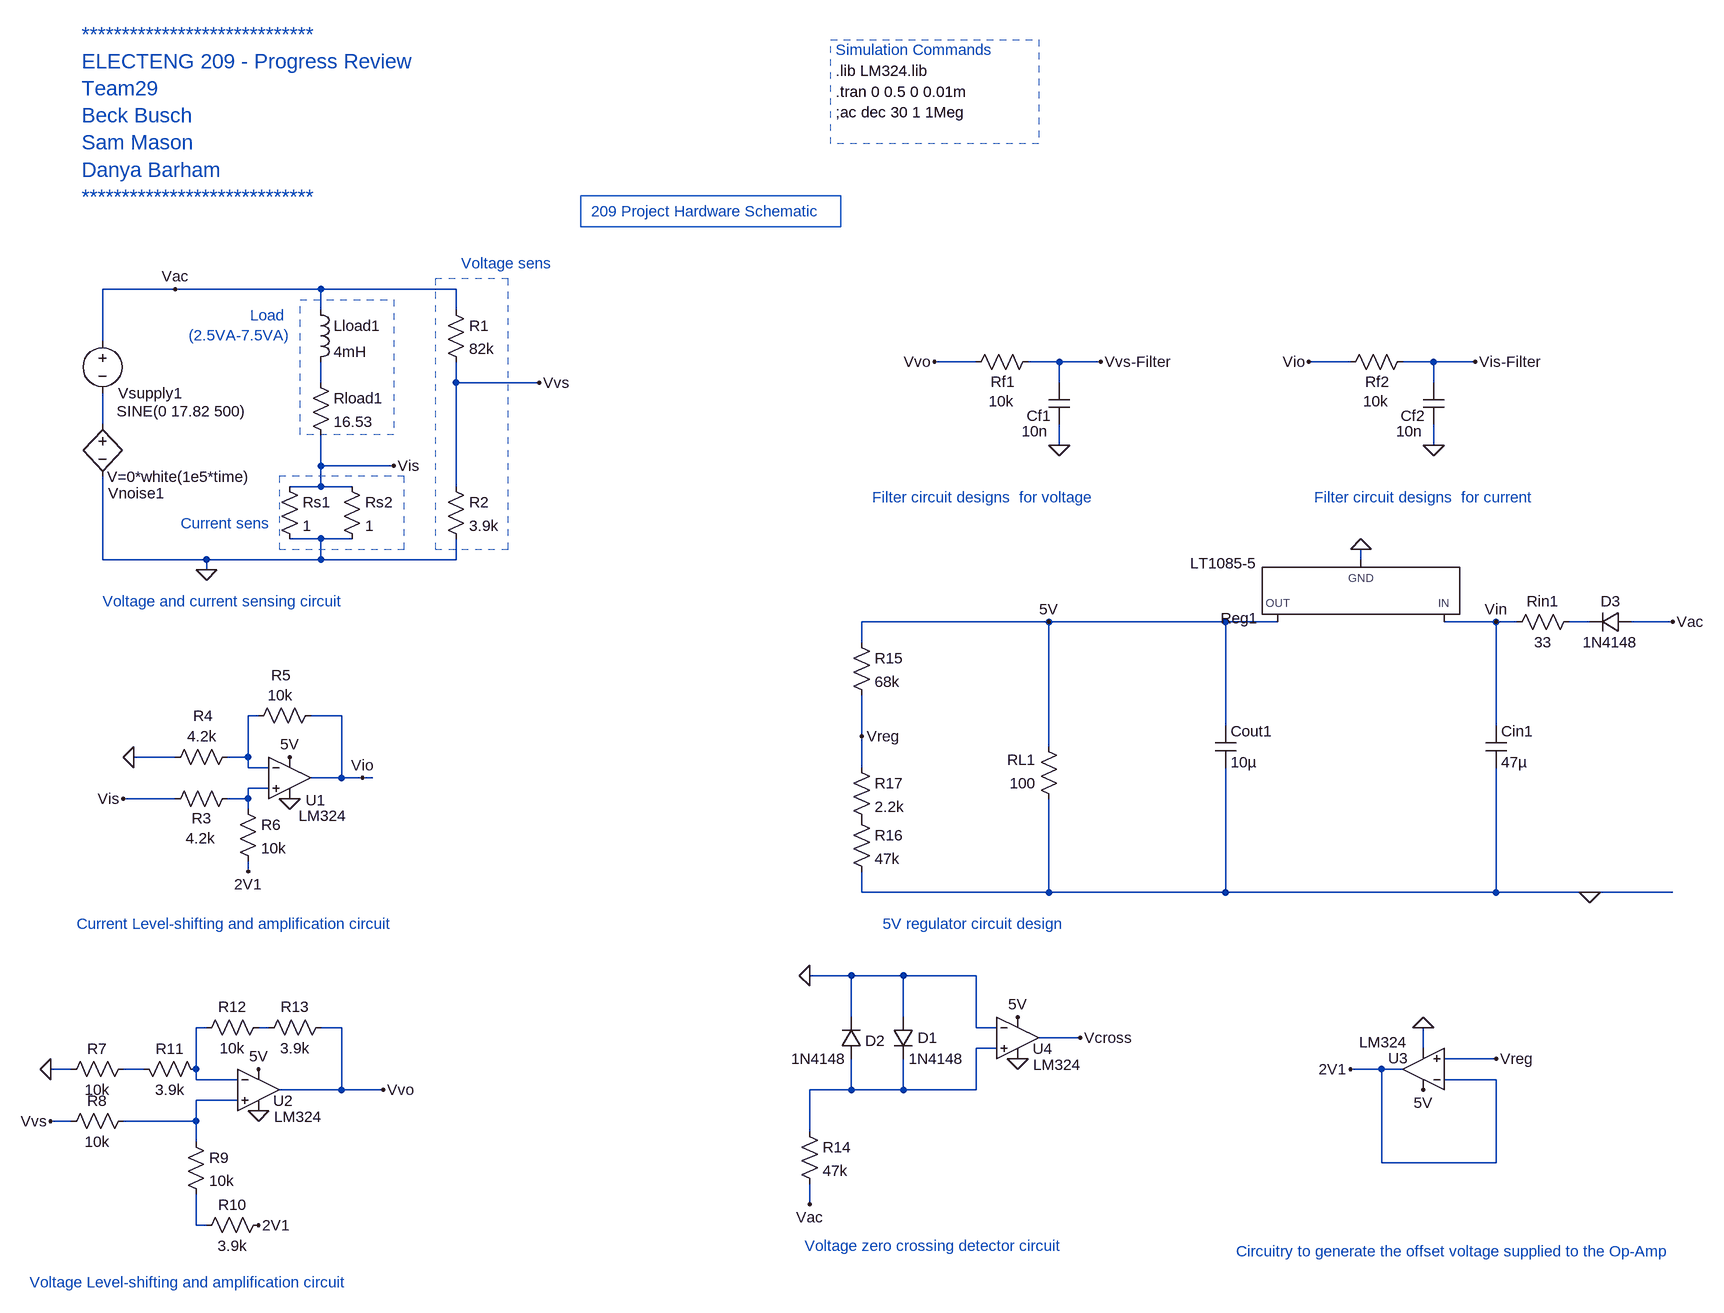
[diagram p0: schematic Danya sorted.asc]
Danya sorted.asc, the LTspice schematic file:
Version 4
SHEET 1 3272 932
WIRE 192 -896 80 -896
WIRE 416 -896 192 -896
WIRE 624 -896 416 -896
WIRE 416 -864 416 -896
WIRE 624 -864 624 -896
WIRE 80 -816 80 -896
WIRE 1424 -784 1360 -784
WIRE 1552 -784 1504 -784
WIRE 1616 -784 1552 -784
WIRE 2000 -784 1936 -784
WIRE 2128 -784 2080 -784
WIRE 2192 -784 2128 -784
WIRE 416 -752 416 -784
WIRE 624 -752 624 -784
WIRE 752 -752 624 -752
WIRE 1552 -752 1552 -784
WIRE 2128 -752 2128 -784
WIRE 80 -688 80 -736
WIRE 1552 -656 1552 -688
WIRE 2128 -656 2128 -688
WIRE 416 -624 416 -672
WIRE 528 -624 416 -624
WIRE 416 -592 416 -624
WIRE 416 -592 368 -592
WIRE 464 -592 416 -592
WIRE 624 -592 624 -752
WIRE 416 -512 368 -512
WIRE 464 -512 416 -512
WIRE 80 -480 80 -608
WIRE 240 -480 80 -480
WIRE 416 -480 416 -512
WIRE 416 -480 240 -480
WIRE 624 -480 624 -512
WIRE 624 -480 416 -480
WIRE 2016 -480 2016 -496
WIRE 240 -464 240 -480
WIRE 1536 -384 1248 -384
WIRE 1808 -384 1536 -384
WIRE 1888 -384 1808 -384
WIRE 2224 -384 2144 -384
WIRE 2256 -384 2224 -384
WIRE 2368 -384 2336 -384
WIRE 2496 -384 2432 -384
WIRE 1248 -352 1248 -384
WIRE 320 -240 304 -240
WIRE 448 -240 400 -240
WIRE 1808 -224 1808 -384
WIRE 2224 -224 2224 -384
WIRE 1248 -208 1248 -272
WIRE 1536 -192 1536 -384
WIRE 192 -176 128 -176
WIRE 304 -176 304 -240
WIRE 304 -176 272 -176
WIRE 304 -160 304 -176
WIRE 336 -160 304 -160
WIRE 1248 -160 1248 -208
WIRE 448 -144 448 -240
WIRE 448 -144 400 -144
WIRE 480 -144 448 -144
WIRE 496 -144 480 -144
WIRE 336 -128 304 -128
WIRE 192 -112 112 -112
WIRE 304 -112 304 -128
WIRE 304 -112 272 -112
WIRE 304 -96 304 -112
WIRE 304 0 304 -16
WIRE 1248 32 1248 0
WIRE 1536 32 1536 -112
WIRE 1536 32 1248 32
WIRE 1808 32 1808 -160
WIRE 1808 32 1536 32
WIRE 2224 32 2224 -160
WIRE 2224 32 1808 32
WIRE 2368 32 2224 32
WIRE 2496 32 2368 32
WIRE 1232 160 1168 160
WIRE 1312 160 1232 160
WIRE 1424 160 1312 160
WIRE 1232 224 1232 160
WIRE 1312 224 1312 160
WIRE 240 240 224 240
WIRE 336 240 320 240
WIRE 448 240 416 240
WIRE 1424 240 1424 160
WIRE 1456 240 1424 240
WIRE 1584 256 1520 256
WIRE 1456 272 1424 272
WIRE 2112 272 2112 240
WIRE 2224 288 2144 288
WIRE 32 304 0 304
WIRE 144 304 112 304
WIRE 224 304 224 240
WIRE 2048 304 2000 304
WIRE 2080 304 2048 304
WIRE 224 320 224 304
WIRE 288 320 224 320
WIRE 2224 320 2144 320
WIRE 448 336 448 240
WIRE 448 336 352 336
WIRE 512 336 448 336
WIRE 1232 336 1232 288
WIRE 1232 336 1168 336
WIRE 1312 336 1312 288
WIRE 1312 336 1232 336
WIRE 1424 336 1424 272
WIRE 1424 336 1312 336
WIRE 288 352 224 352
WIRE 32 384 0 384
WIRE 224 384 224 352
WIRE 224 384 112 384
WIRE 1168 400 1168 336
WIRE 224 416 224 384
WIRE 2048 448 2048 304
WIRE 2224 448 2224 320
WIRE 2224 448 2048 448
WIRE 1168 512 1168 480
WIRE 224 544 224 496
WIRE 240 544 224 544
FLAG 192 -896 Vac
FLAG 528 -624 Vis
FLAG 240 -464 0
FLAG 368 -112 0
FLAG 368 -176 5V
FLAG 480 -144 Vio
FLAG 304 0 2V1
FLAG 128 -176 0
FLAG 112 -112 Vis
FLAG 0 304 0
FLAG 320 304 5V
FLAG 320 368 0
FLAG 320 544 2V1
FLAG 512 336 Vvo
FLAG 0 384 Vvs
FLAG 752 -752 Vvs
FLAG 1552 -656 0
FLAG 1616 -784 Vvs-Filter
FLAG 2128 -656 0
FLAG 2192 -784 Vis-Filter
FLAG 1360 -784 Vvo
FLAG 1936 -784 Vio
FLAG 1168 160 0
FLAG 2112 240 0
FLAG 2112 336 5V
FLAG 2000 304 2V1
FLAG 2224 -384 Vin
FLAG 1536 -384 5V
FLAG 2016 -496 0
FLAG 2496 -384 Vac
FLAG 1168 512 Vac
FLAG 1488 288 0
FLAG 1488 224 5V
FLAG 1584 256 Vcross
FLAG 2368 32 0
FLAG 1248 -208 Vreg
FLAG 2224 288 Vreg
SYMBOL voltage 80 -832 R0
WINDOW 0 24 96 Left 2
WINDOW 3 22 124 Left 2
WINDOW 123 0 0 Left 0
WINDOW 39 0 0 Left 0
SYMATTR InstName Vsupply1
SYMATTR Value SINE(0 17.82 500)
SYMBOL res 400 -768 R0
SYMATTR InstName Rload1
SYMATTR Value 16.53
SYMBOL ind 400 -880 R0
SYMATTR InstName Lload1
SYMATTR Value 4mH
SYMBOL res 352 -608 R0
SYMATTR InstName Rs1
SYMATTR Value 1
SYMBOL res 448 -608 R0
SYMATTR InstName Rs2
SYMATTR Value 1
SYMBOL res 608 -880 R0
SYMATTR InstName R1
SYMATTR Value 82k
SYMBOL res 608 -608 R0
SYMATTR InstName R2
SYMATTR Value 3.9k
SYMBOL bv 80 -704 R0
WINDOW 0 9 122 Left 2
WINDOW 3 7 97 Left 2
SYMATTR InstName Vnoise1
SYMATTR Value V=0*white(1e5*time)
SYMBOL Opamps/opamp2 368 -208 R0
WINDOW 0 25 98 Left 2
WINDOW 3 14 122 Left 2
SYMATTR InstName U1
SYMATTR Value LM324
SYMBOL res 288 -128 R90
WINDOW 0 62 55 VBottom 2
WINDOW 3 61 57 VTop 2
SYMATTR InstName R3
SYMATTR Value 4.2k
SYMBOL res 288 -192 R90
WINDOW 0 -32 53 VBottom 2
WINDOW 3 -32 55 VTop 2
SYMATTR InstName R4
SYMATTR Value 4.2k
SYMBOL res 416 -256 R90
WINDOW 0 -30 61 VBottom 2
WINDOW 3 -31 62 VTop 2
SYMATTR InstName R5
SYMATTR Value 10k
SYMBOL res 288 -112 R0
SYMATTR InstName R6
SYMATTR Value 10k
SYMBOL res 128 288 R90
WINDOW 0 0 56 VBottom 2
WINDOW 3 32 56 VTop 2
SYMATTR InstName R7
SYMATTR Value 10k
SYMBOL res 128 368 R90
WINDOW 0 0 56 VBottom 2
WINDOW 3 32 56 VTop 2
SYMATTR InstName R8
SYMATTR Value 10k
SYMBOL res 208 400 R0
SYMATTR InstName R9
SYMATTR Value 10k
SYMBOL res 336 528 R90
WINDOW 0 0 56 VBottom 2
WINDOW 3 32 56 VTop 2
SYMATTR InstName R10
SYMATTR Value 3.9k
SYMBOL res 128 288 M90
WINDOW 0 0 56 VBottom 2
WINDOW 3 32 56 VTop 2
SYMATTR InstName R11
SYMATTR Value 3.9k
SYMBOL res 336 224 R90
WINDOW 0 0 56 VBottom 2
WINDOW 3 32 56 VTop 2
SYMATTR InstName R12
SYMATTR Value 10k
SYMBOL res 432 224 R90
WINDOW 0 0 56 VBottom 2
WINDOW 3 32 56 VTop 2
SYMATTR InstName R13
SYMATTR Value 3.9k
SYMBOL Opamps/opamp2 320 272 R0
WINDOW 0 23 81 Left 2
WINDOW 3 24 105 Left 2
SYMATTR InstName U2
SYMATTR Value LM324
SYMBOL res 1520 -800 R90
WINDOW 0 62 55 VBottom 2
WINDOW 3 61 57 VTop 2
SYMATTR InstName Rf1
SYMATTR Value 10k
SYMBOL cap 1568 -688 R180
WINDOW 0 29 13 Left 2
WINDOW 3 33 -11 Left 2
SYMATTR InstName Cf1
SYMATTR Value 10n
SYMBOL res 2096 -800 R90
WINDOW 0 62 55 VBottom 2
WINDOW 3 61 57 VTop 2
SYMATTR InstName Rf2
SYMATTR Value 10k
SYMBOL cap 2144 -688 R180
WINDOW 0 29 13 Left 2
WINDOW 3 33 -11 Left 2
SYMATTR InstName Cf2
SYMATTR Value 10n
SYMBOL diode 1296 224 R0
WINDOW 0 38 32 Left 2
SYMATTR InstName D1
SYMATTR Value 1N4148
SYMBOL res 1152 384 R0
SYMATTR InstName R14
SYMATTR Value 47k
SYMBOL diode 1248 288 R180
WINDOW 0 -36 28 Left 2
WINDOW 3 24 0 Left 2
SYMATTR InstName D2
SYMATTR Value 1N4148
SYMBOL Opamps/opamp2 2112 368 R180
WINDOW 0 23 81 Left 2
WINDOW 3 24 105 Left 2
SYMATTR InstName U3
SYMATTR Value LM324
SYMBOL res 2240 -368 R270
WINDOW 0 32 56 VTop 2
WINDOW 3 0 56 VBottom 2
SYMATTR InstName Rin1
SYMATTR Value 33
SYMBOL diode 2432 -400 R90
WINDOW 0 0 32 VBottom 2
WINDOW 3 32 32 VTop 2
SYMATTR InstName D3
SYMATTR Value 1N4148
SYMBOL cap 2208 -224 R0
SYMATTR InstName Cin1
SYMATTR Value 47µ
SYMATTR SpiceLine Rser=0.001
SYMBOL cap 1792 -224 R0
SYMATTR InstName Cout1
SYMATTR Value 10µ
SYMATTR SpiceLine Rser=0.001
SYMBOL res 1552 -96 R180
WINDOW 0 36 76 Left 2
WINDOW 3 36 40 Left 2
SYMATTR InstName RL1
SYMATTR Value 100
SYMBOL PowerProducts/LT1085-5 2016 -384 R180
SYMATTR InstName Reg1
SYMBOL res 1232 -368 R0
SYMATTR InstName R15
SYMATTR Value 68k
SYMBOL res 1232 -96 R0
SYMATTR InstName R16
SYMATTR Value 47k
SYMBOL res 1232 -176 R0
SYMATTR InstName R17
SYMATTR Value 2.2k
SYMBOL Opamps/opamp2 1488 192 R0
WINDOW 0 23 81 Left 2
WINDOW 3 24 105 Left 2
SYMATTR InstName U4
SYMATTR Value LM324
TEXT 48 -1288 Left 3 ;*****************************\nELECTENG 209 - Progress Review\nTeam29\nBeck Busch\nSam Mason\nDanya Barham\n*****************************
TEXT 368 -856 Right 2 ;Load \n(2.5VA-7.5VA)
TEXT 1208 -1168 Left 2 !;ac dec 30 1 1Meg
TEXT 1208 -1264 Left 2 ;Simulation Commands
TEXT 1208 -1200 Left 2 !.tran 0 0.5 0 0.01m
TEXT 1208 -1232 Left 2 !.lib LM324.lib
TEXT 80 -416 Left 2 ;Voltage and current sensing circuit
TEXT 40 80 Left 2 ;Current Level-shifting and amplification circuit
TEXT -32 632 Left 2 ;Voltage Level-shifting and amplification circuit
TEXT 1264 -576 Left 2 ;Filter circuit designs  for voltage
TEXT 1944 -576 Left 2 ;Filter circuit designs  for current
TEXT 1280 80 Left 2 ;5V regulator circuit design
TEXT 1824 584 Left 2 ;Circuitry to generate the offset voltage supplied to the Op-Amp
TEXT 1160 576 Left 2 ;Voltage zero crossing detector circuit
TEXT 200 -536 Left 2 ;Current sens
TEXT 632 -936 Left 2 ;Voltage sens
TEXT 832 -1016 Left 2 ;209 Project Hardware Schematic
RECTANGLE Normal 1520 -1120 1200 -1280 2
RECTANGLE Normal 528 -672 384 -880 2
RECTANGLE Normal 352 -496 544 -608 2
RECTANGLE Normal 704 -912 592 -496 2
RECTANGLE Normal 1216 -992 816 -1040

The netlist it stands for:
* Danya sorted.asc
Vsupply1 Vac N002 SINE(0 17.82 500)
Rload1 N001 Vis 16.53
Lload1 Vac N001 4mH
Rs1 Vis 0 1
Rs2 Vis 0 1
R1 Vac Vvs 82k
R2 Vvs 0 3.9k
B§Vnoise1 N002 0 V=0*white(1e5*time)
XU1 N005 N004 5V 0 Vio LM324  ; pins In+ In- V+ V- OUT
R3 N005 Vis 4.2k
R4 N004 0 4.2k
R5 Vio N004 10k
R6 N005 2V1 10k
R7 N009 0 10k
R8 N010 Vvs 10k
R9 N010 N011 10k
R10 2V1 N011 3.9k
R11 N009 N006 3.9k
R12 N007 N006 10k
R13 Vvo N007 3.9k
XU2 N010 N006 5V 0 Vvo LM324  ; pins In+ In- V+ V- OUT
Rf1 Vvs-Filter Vvo 10k
Cf1 0 Vvs-Filter 10n
Rf2 Vis-Filter Vio 10k
Cf2 0 Vis-Filter 10n
D1 0 N008 1N4148
R14 N008 Vac 47k
D2 N008 0 1N4148
XU3 Vreg 2V1 5V 0 2V1 LM324  ; pins In+ In- V+ V- OUT
Rin1 Vin N003 33
D3 Vac N003 1N4148
Cin1 Vin 0 47µ Rser=0.001
Cout1 5V 0 10µ Rser=0.001
RL1 0 5V 100
XReg1 0 5V Vin LT1085-5  ; pins GND OUT IN
R15 5V Vreg 68k
R16 P001 0 47k
R17 Vreg P001 2.2k
XU4 N008 0 5V 0 Vcross LM324  ; pins In+ In- V+ V- OUT
.model D D
.lib standard.dio
* *****************************
* ELECTENG 209 - Progress Review
* Team29
* Beck Busch
* Sam Mason
* Danya Barham
* *****************************
* Load
* (2.5VA-7.5VA)
;ac dec 30 1 1Meg
* Simulation Commands
.tran 0 0.5 0 0.01m
.lib LM324.lib
* Voltage and current sensing circuit
* Current Level-shifting and amplification circuit
* Voltage Level-shifting and amplification circuit
* Filter circuit designs  for voltage
* Filter circuit designs  for current
* 5V regulator circuit design
* Circuitry to generate the offset voltage supplied to the Op-Amp
* Voltage zero crossing detector circuit
* Current sens
* Voltage sens
* 209 Project Hardware Schematic
.backanno
.end